# EasyEDA Pro project 校园作息系统.eprj

# Schematic Schematic1
Board Name: Board1; Create Date: 2024-12-30; Page Name: P1; Project Name: 校园作息系统; Schematic Name: Schematic1; Update Date: 2025-01-31; Company: 嘉立创EDA; Page Size: A4; Version: V1.0
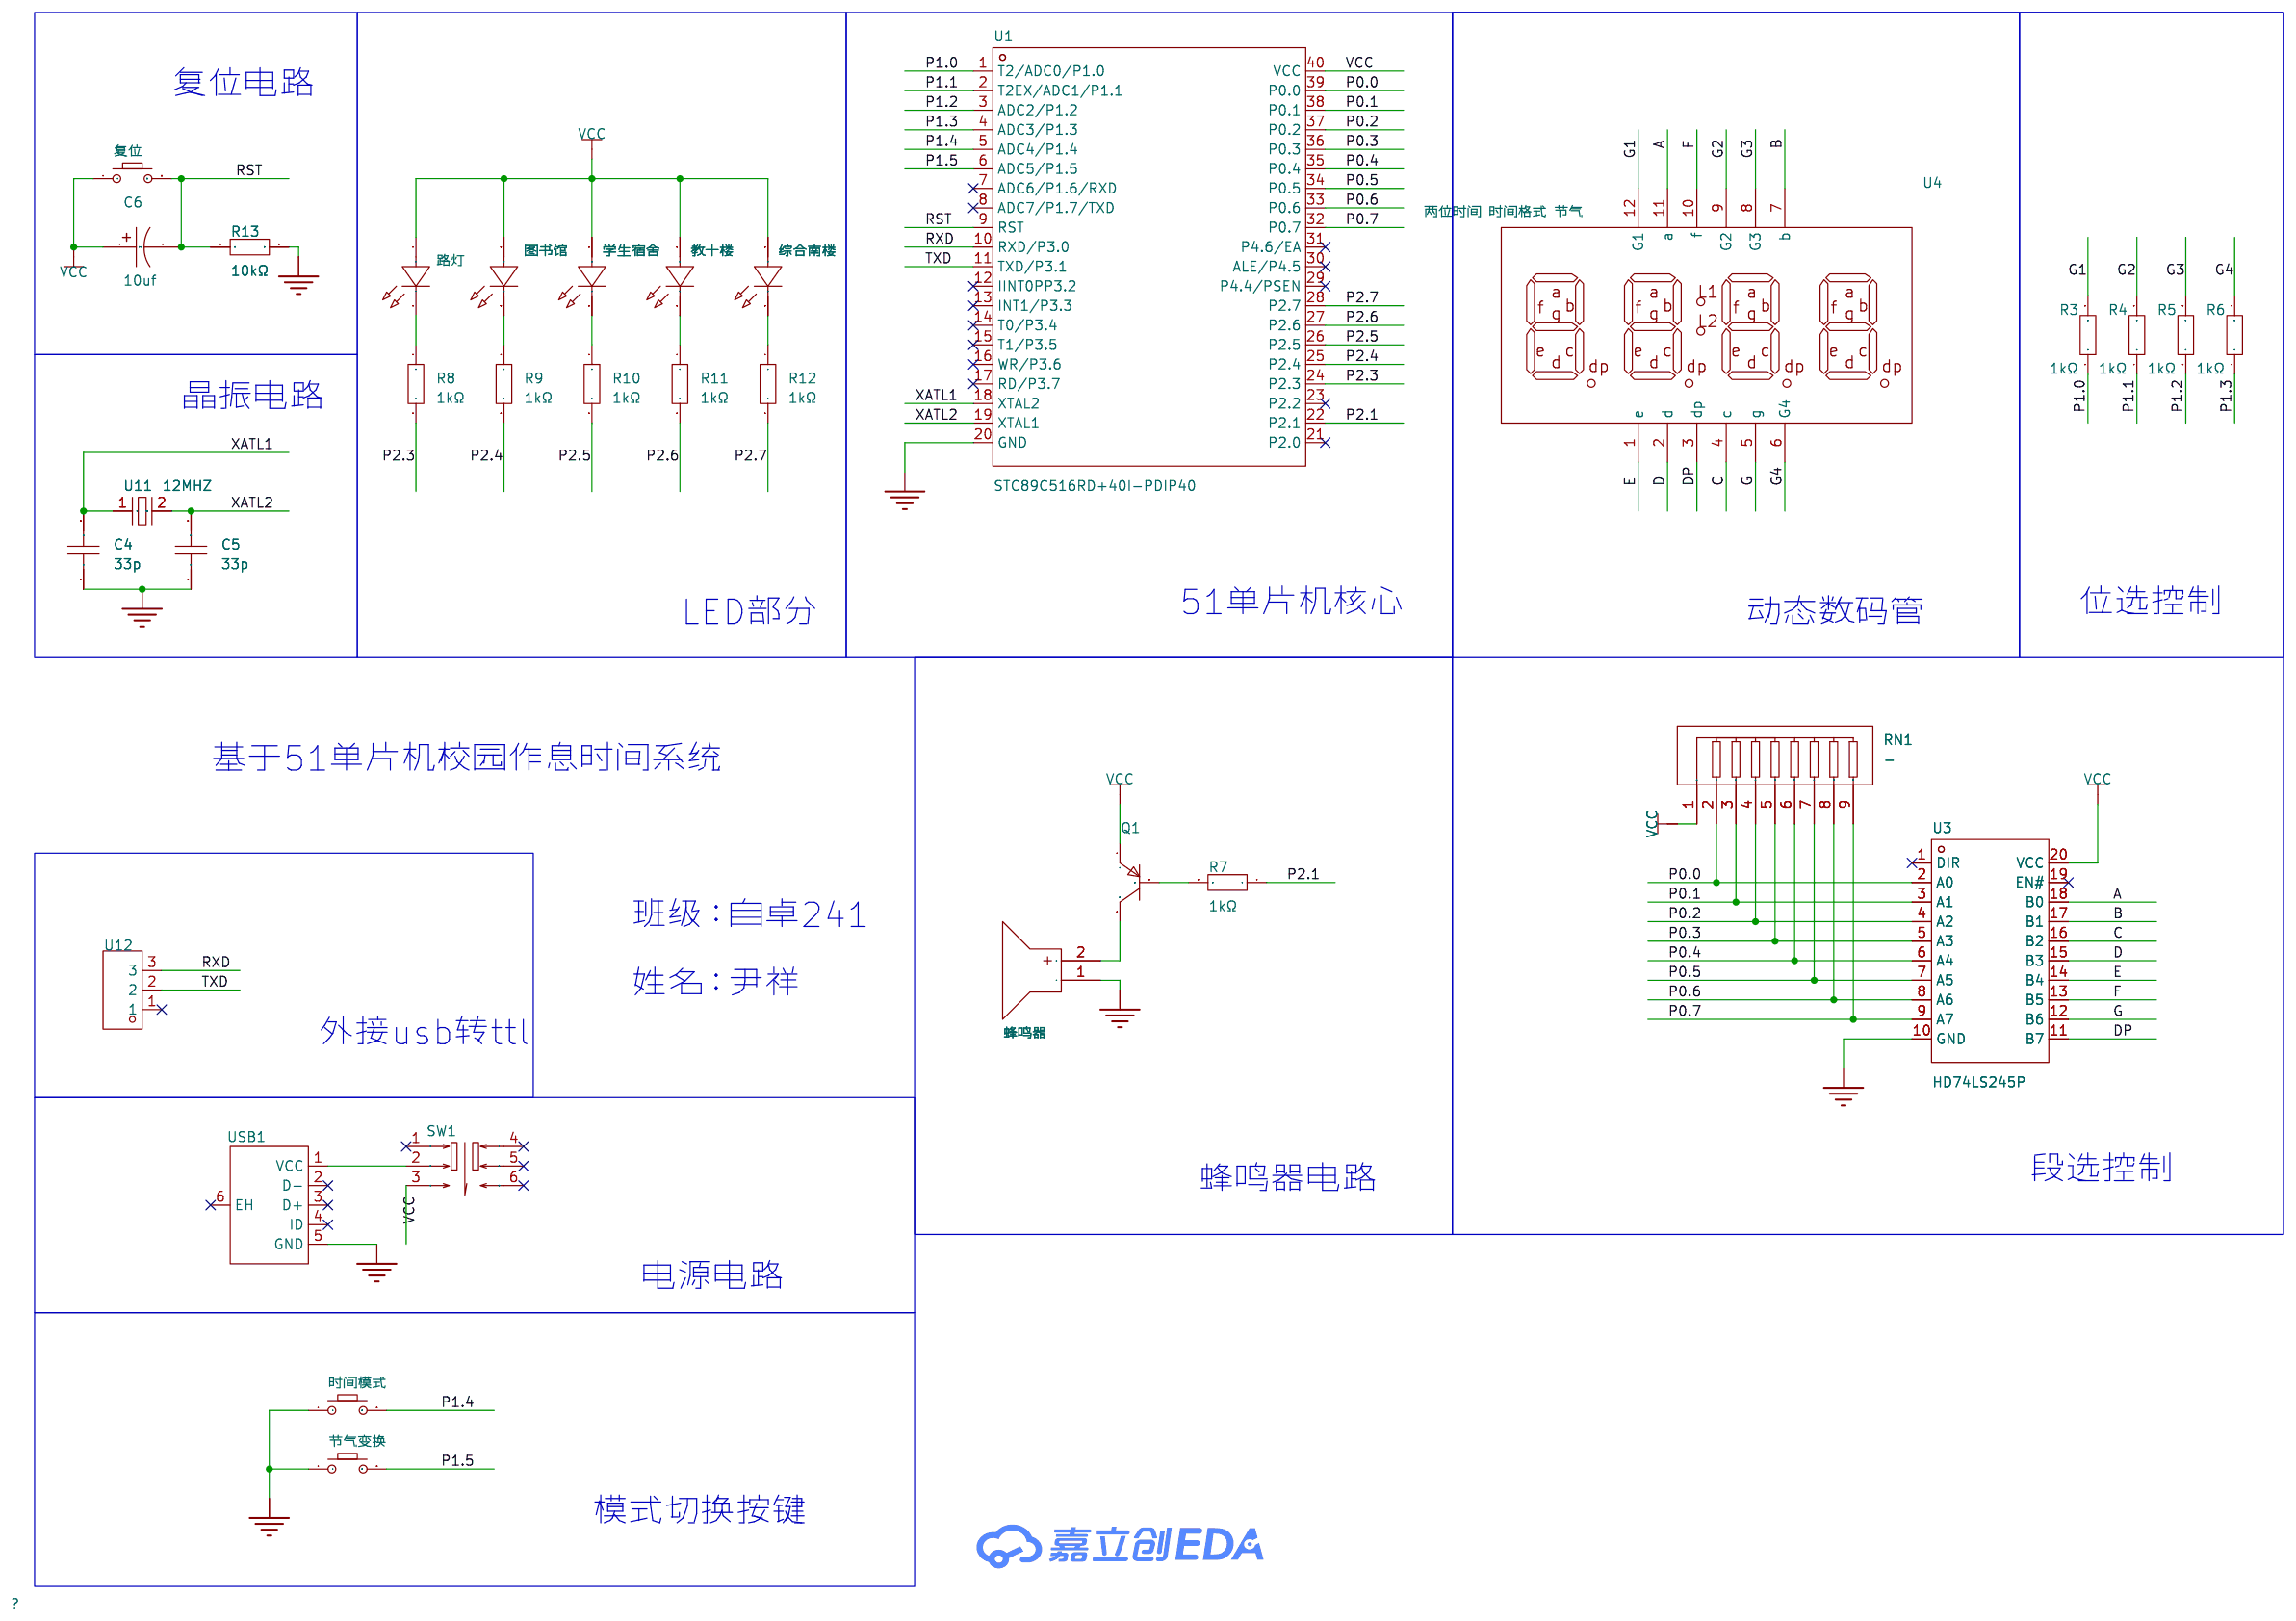
[diagram p0: schematic sheet]

## Parts
C4  33p  [CAP-TH_L10.0-W4.5-P7.50-D0.6]
C5  33p  [CAP-TH_L10.0-W4.5-P7.50-D0.6]
C6  10uf  [CAP-TH_BD10.0-P5.00-D0.6-FD]
Q1  -  [S8550P_TO-92]
R3  1kΩ  [Res_1/8W]
R4  1kΩ  [Res_1/8W]
R5  1kΩ  [Res_1/8W]
R6  1kΩ  [Res_1/8W]
R7  1kΩ  [Res_1/8W]
R8  1kΩ  [Res_1/8W]
R9  1kΩ  [Res_1/8W]
R10  1kΩ  [Res_1/8W]
R11  1kΩ  [Res_1/8W]
R12  1kΩ  [Res_1/8W]
R13  10kΩ  [Res_1/8W]
RN1  -  [RES-ARRAY-TH_9P-P2.54-D1.0]
SW1  SP-2212  [SW-TH_6P-L7.2-W7.2-P2.00-LS5.0]
U1  STC89C516RD+40I-PDIP40  [DIP-40_L52.3-W13.9-P2.54-LS15.2-BL]
U3  HD74LS245P  [DIP-20_L26.8-W6.4-P2.54-LS7.6-BL]
U4  两位时间 时间格式 节气  [LED-SEG-TH_12P-L32.1-W10.0-P12.7-S7.62-BL]
U11  12MHZ  [HC-49S_L11.0-W4.7-P4.88]
U12  2.54MM间距单排插针3P/高度11mm  [HDR-TH_3P-P2.54-V-M]
USB1  -  [USB_Micro]
图书馆  图书馆  [LED-TH_BD3.0-P2.54-FD]
复位  -  [Key_TH_3.5x6x4.3]
学生宿舍  学生宿舍  [LED-TH_BD3.0-P2.54-FD]
打铃  蜂鸣器  [BUZ-TH_BD12.0-P6.00-D0.9-RD]
教十楼  教十楼  [LED-TH_BD3.0-P2.54-FD]
时间模式  -  [Key_TH_3.5x6x4.3]
综合南楼  综合南楼  [LED-TH_BD3.0-P2.54-FD]
节气变换  -  [Key_TH_3.5x6x4.3]
路灯  路灯  [LED-TH_BD3.0-P2.54-FD]

## Library data of the parts
C4 C5 = 250V 0.1uF 5% CBB电容: LCSC Part Name: 0.1uF 5% 250V 电容; Supplier Part: C46804; Supplier Footprint: CBB电容 7.5mm; JLCPCB Part Class: 扩展库; Supplier: LCSC
C6 = LF221M1HBKJ1013VGN: Supplier Part: C9900022454; Supplier Footprint: 直插电解电容（高频）,220uF±20%,50V,Pitch=5mm,φ10mm,H13mm,剪脚，脚长3.6mm，佳维诚; JLCPCB Part Class: 扩展库; Supplier: LCSC
Q1 = S8550_TO_PNP: Supplier Footprint: TO-92
R3-R13 = Res_AXIAL-1/8W: Supplier Footprint: 轴向引线
RN1 = 排阻 10 K 5%: LCSC Part Name: 10KΩ (103) ±5%; Supplier Part: C26615; Supplier Footprint: 插件; JLCPCB Part Class: 扩展库; Supplier: LCSC
SW1 = SP-2212: 电路结构:双刀双掷;自锁/无锁:自锁;安装方式:直插;触点电流:100mA;额定电压 (DC):30V;作用力:230gf;机械寿命:1.2万次;; LCSC Part Name: 轻触开关自锁; Supplier Part: C589287; Manufacturer: RISHENG(日昇); Supplier Footprint: 插件; JLCPCB Part Class: 扩展库; Datasheet: https://atta.szlcsc.com/upload/public/pdf/source/20200922/C589287_2DDFEABD4C802D7BFB6520C1CABFFDEF.pdf; Supplier: LCSC; Circuit: 双刀双掷; Self Lock / No Lock: 自锁; Actuator Style: 矩形柱塞; Mounting Style: 直插; Contact Current: 100mA; Voltage Rating (DC): 30V; Insulation Resistance: 100MΩ; Actuator/Cap Color: 蓝色; Pin Style: PC引脚; Operating Force: 230gf; Mechanical Life: 1.2万次
U1 = STC89C516RD+40I-PDIP40: Supplier Part: C52225; Manufacturer: STC(宏晶); Supplier Footprint: DIP-40; JLCPCB Part Class: 扩展库; Datasheet: https://atta.szlcsc.com/upload/public/pdf/source/20180614/C87831_BBAF7FB8B286C29ACE4E9B180C033FEC.pdf; Supplier: LCSC; CPU Core: 51系列; Program Storage Size: 61KB; RAM Size: 1.25KB; GPIO Ports Number: 35; Operating Voltage Range: 3.5V~5.5V; Program Memory Type: FLASH; Operating Temperature Range: -40℃~+85℃; 16Bit Timer: 3; UART/USART: 1; Peripheral/Function: 看门狗; Watchdog: 有
U3 = HD74LS245P: Supplier Part: C5349; Manufacturer: RENESAS(瑞萨)/IDT; Supplier Footprint: DIP-20; JLCPCB Part Class: 扩展库; Datasheet: https://atta.szlcsc.com/upload/public/pdf/source/20161119/1479540128687.pdf; Supplier: LCSC
U4 = 0.28 4位 数码管: Supplier Part: C9900013351; Supplier Footprint: DIP-12; JLCPCB Part Class: 扩展库; Supplier: LCSC
U11 = 直插晶振: Supplier Part: C9900021663; Supplier Footprint: HC-49S; JLCPCB Part Class: 扩展库; Supplier: LCSC
U12 = 2.54MM间距单排插针3P/高度11mm: Supplier Part: C9900010938; JLCPCB Part Class: 扩展库; Supplier: LCSC
USB1 = USB_Micro-B: Supplier Footprint: SMD
图书馆 学生宿舍 教十楼 综合南楼 路灯 = 3mmFIR: Supplier Part: C9900095018; Supplier Footprint: LED-TH_LED-3MM_RED; JLCPCB Part Class: 扩展库; Supplier: LCSC
复位 时间模式 节气变换 = Key_TH_3.5x6x4.3: Supplier Footprint: 插件
打铃 = buzzer: Supplier Part: C9900014030; JLCPCB Part Class: 扩展库; Supplier: LCSC

## Nets
GND: C4.1 C5.1 R13.2 U1.20(GND) U3.10(GND) USB1.5(GND) 打铃.1(-) 时间模式.A 节气变换.A
VCC: C6.1 Q1.1(E) RN1.1 SW1.3 U1.40(VCC) U3.20(VCC) 图书馆.1(A) 复位.A 学生宿舍.1(A) 教十楼.1(A) 综合南楼.1(A) 路灯.1(A)
A: U3.18(B0) U4.11(a)
B: U3.17(B1) U4.7(b)
C: U3.16(B2) U4.4(c)
D: U3.15(B3) U4.2(d)
DP: U3.11(B7) U4.3(dp)
E: U3.14(B4) U4.1(e)
F: U3.13(B5) U4.10(f)
G: U3.12(B6) U4.5(g)
G1: R3.2 U4.12(G1)
G2: R4.2 U4.9(G2)
G3: R5.2 U4.8(G3)
G4: R6.2 U4.6(G4)
P0.0: RN1.2 U1.39(P0.0) U3.2(A0)
P0.1: RN1.3 U1.38(P0.1) U3.3(A1)
P0.2: RN1.4 U1.37(P0.2) U3.4(A2)
P0.3: RN1.5 U1.36(P0.3) U3.5(A3)
P0.4: RN1.6 U1.35(P0.4) U3.6(A4)
P0.5: RN1.7 U1.34(P0.5) U3.7(A5)
P0.6: RN1.8 U1.33(P0.6) U3.8(A6)
P0.7: RN1.9 U1.32(P0.7) U3.9(A7)
P1.0: R3.1 U1.1(T2/ADC0/P1.0)
P1.1: R4.1 U1.2(T2EX/ADC1/P1.1)
P1.2: R5.1 U1.3(ADC2/P1.2)
P1.3: R6.1 U1.4(ADC3/P1.3)
P1.4: U1.5(ADC4/P1.4) 时间模式.B
P1.5: U1.6(ADC5/P1.5) 节气变换.B
P2.1: R7.1 U1.22(P2.1)
P2.3: R8.2 U1.24(P2.3)
P2.4: R9.2 U1.25(P2.4)
P2.5: R10.2 U1.26(P2.5)
P2.6: R11.2 U1.27(P2.6)
P2.7: R12.2 U1.28(P2.7)
RST: C6.2 R13.1 U1.9(RST) 复位.B
RXD: U1.10(RXD/P3.0) U12.3
TXD: U1.11(TXD/P3.1) U12.2
XATL1: C4.2 U1.18(XTAL2) U11.1
XATL2: C5.2 U1.19(XTAL1) U11.2(GND)
$1N10647: Q1.3(C) 打铃.2(+)
$1N10659: Q1.2(B) R7.2
$1N10681: SW1.2 USB1.1(VCC)
$1N11318: R8.1 路灯.2(K)
$1N11325: R9.1 图书馆.2(K)
$1N11329: R10.1 学生宿舍.2(K)
$1N11337: R11.1 教十楼.2(K)
$1N11342: R12.1 综合南楼.2(K)

Not connected (* = marked no-connect by the designer): SW1 1* 4* 5* 6*; U1 7(ADC6/P1.6/RXD)* 8(ADC7/P1.7/TXD)* 12(IINT0PP3.2)* 13(INT1/P3.3)* 14(T0/P3.4)* 15(T1/P3.5)* 16(WR/P3.6)* 17(RD/P3.7)* 21(P2.0)* 23(P2.2)* 29(P4.4/PSEN)* 30(ALE/P4.5)* 31(P4.6/EA)*; U3 1(DIR)* 19(EN#)*; U12 1*; USB1 2(D-)* 3(D+)* 4(ID)* 6(EH)*

## Notes on the sheet
- 复位电路
- 晶振电路
- 51单片机核心
- 位选控制
- LED部分
- 动态数码管
- 基于51单片机校园作息时间系统
- 班级：自卓241
- 姓名：尹祥
- 外接usb转ttl
- 蜂鸣器电路
- 段选控制
- 电源电路
- 模式切换按键

# Board PCB1
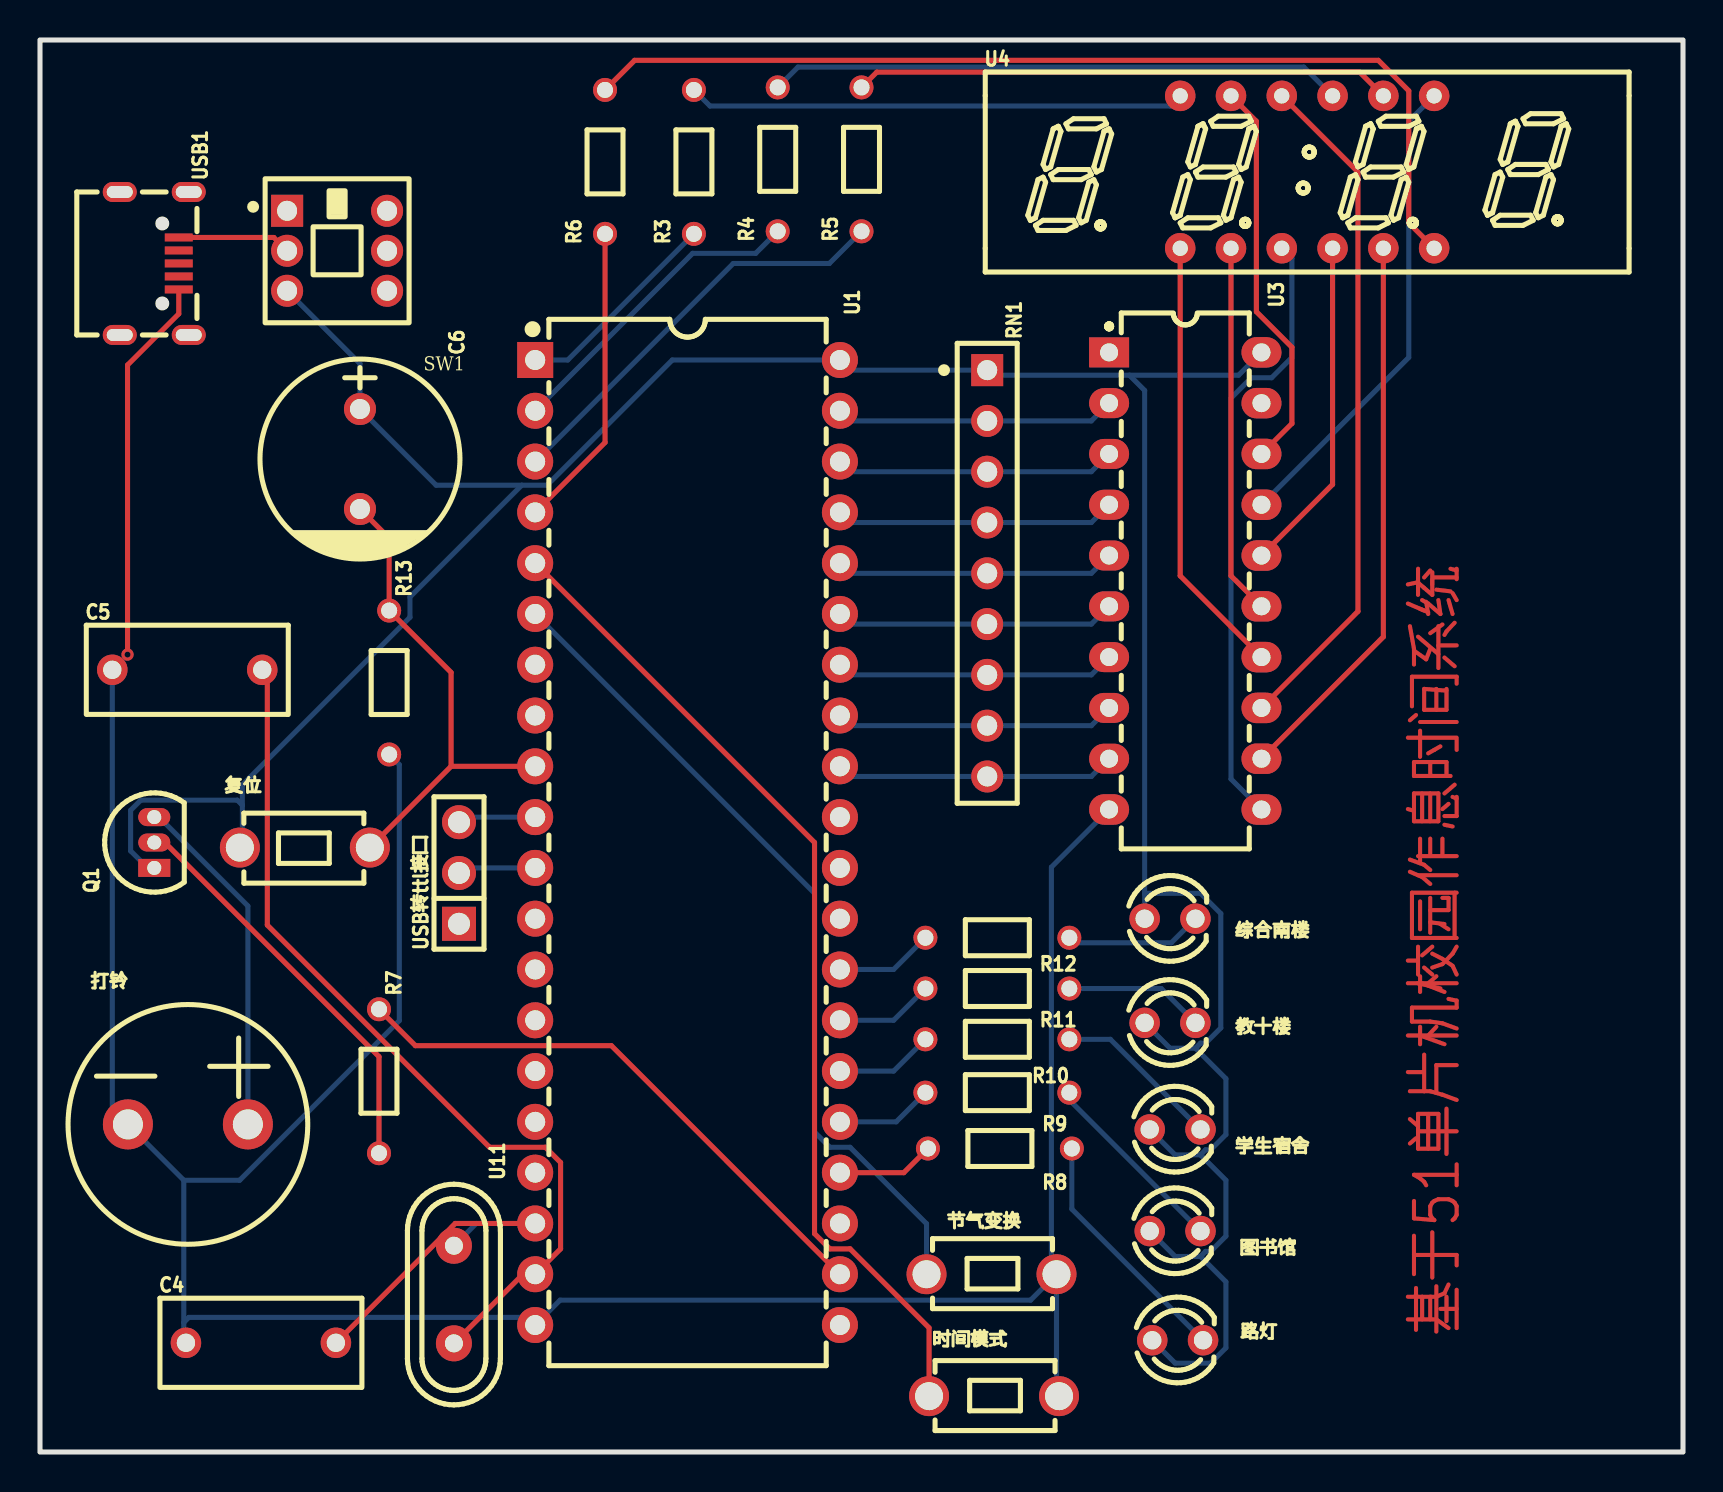
[diagram p1: board, top side]
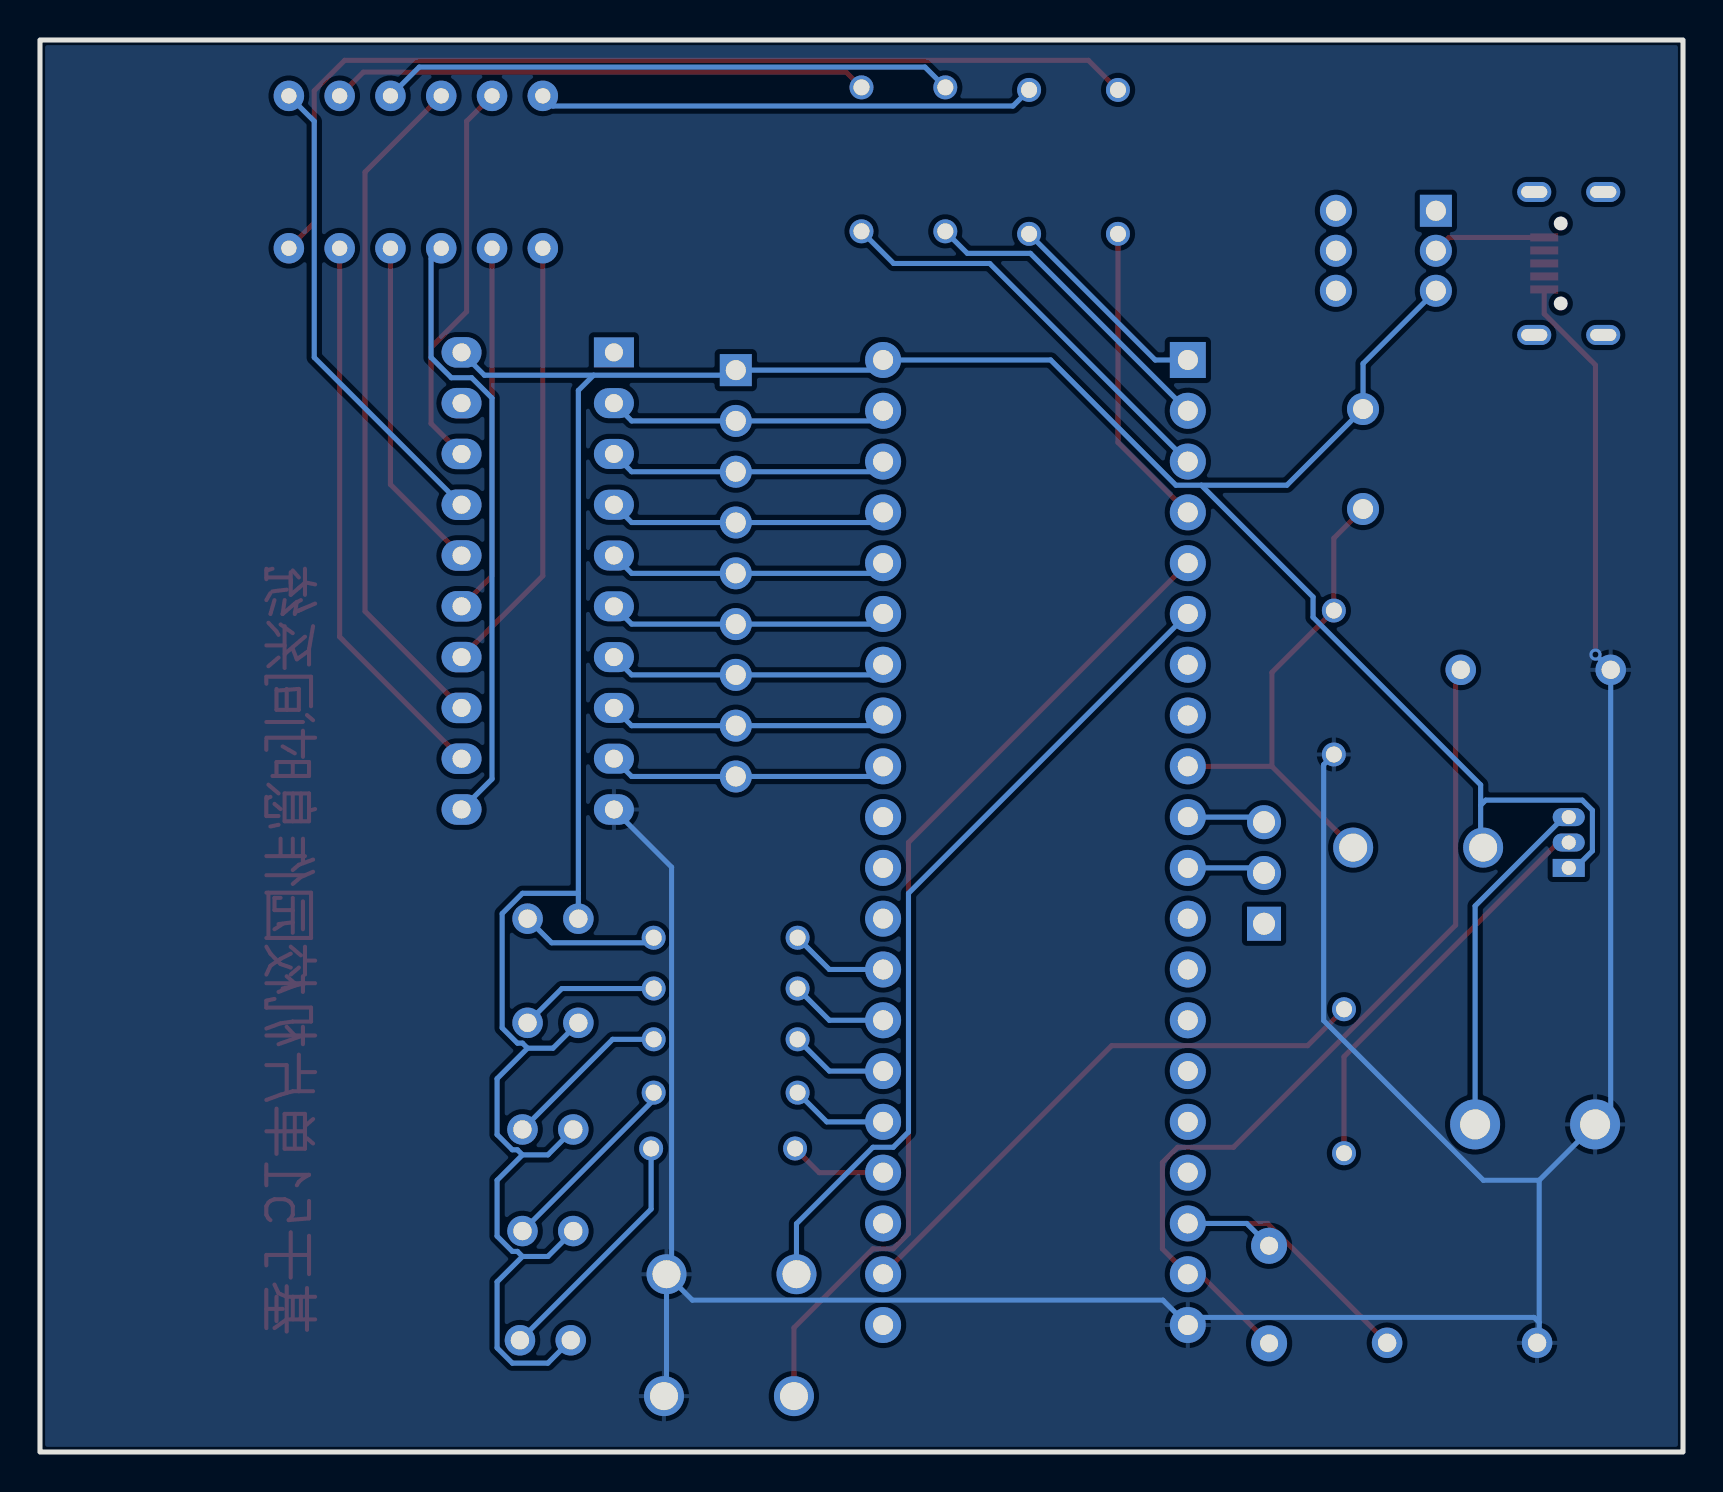
[diagram p2: board, bottom side, seen from below]

Outline 82.17 x 70.61 mm; copper layers: Top Layer, Bottom Layer. Coordinates in mm from the lower left corner of the outline.
Outline path: rectangle 0,70.61 82.17,0
Stack: Top Layer 0.035mm / Dielectric1 1.51mm FR4 er 4.5 / Bottom Layer 0.035mm

## Design rules (mm)
template: JLCPCB Capability(Two Layers Board)
spacing copperThickness1oz (default): track to track 0.102, other pairs 0.152 to 0.3
spacing copperThickness2oz: track to track 0.203, other pairs 0.152 to 0.3
track width copperThickness1oz (default): min 0.127, default 0.254, max 2.54
track width copperThickness2oz: min 0.203, default 0.254, max 2.54
differential pair differentialPair (default): width min 0.127, default 0.254, max 2.54; gap min 0.152, default 0.152
via viaSize (default): diameter min 0.5, default 0.61, max 10; hole min 0.3, default 0.305, max 6.3

## Placement (name value [footprint] x y rotation side)
C4  33p  [CAP-TH_L10.0-W4.5-P7.50-D0.6]  11.05 5.46 0 top
C5  33p  [CAP-TH_L10.0-W4.5-P7.50-D0.6]  7.37 39.12 0 top
C6  10uf  [CAP-TH_BD10.0-P5.00-D0.6-FD]  16 49.66 270 top
Q1  -  [S8550P_TO-92]  5.71 30.48 90 top
R3  1kΩ  [Res_1/8W]  32.77 64.52 90 top
R4  1kΩ  [Res_1/8W]  36.96 64.64 90 top
R5  1kΩ  [Res_1/8W]  41.15 64.64 90 top
R6  1kΩ  [Res_1/8W]  28.32 64.52 90 top
R7  1kΩ  [Res_1/8W]  16.89 18.54 270 top
R8  1kΩ  [Res_1/8W]  48.01 15.24 180 top
R9  1kΩ  [Res_1/8W]  47.88 18.03 180 top
R10  1kΩ  [Res_1/8W]  47.88 20.7 180 top
R11  1kΩ  [Res_1/8W]  47.88 23.24 180 top
R12  1kΩ  [Res_1/8W]  47.88 25.78 180 top
R13  10kΩ  [Res_1/8W]  17.4 38.48 270 top
RN1  -  [RES-ARRAY-TH_9P-P2.54-D1.0]  47.37 43.94 270 top
SW1  SP-2212  [SW-TH_6P-L7.2-W7.2-P2.00-LS5.0]  14.86 60.07 270 top
U1  STC89C516RD+40I-PDIP40  [DIP-40_L52.3-W13.9-P2.54-LS15.2-BL]  32.38 30.48 270 top
U3  HD74LS245P  [DIP-20_L26.8-W6.4-P2.54-LS7.6-BL]  57.28 43.56 270 top
U4  两位时间 时间格式 节气  [LED-SEG-TH_12P-L32.1-W10.0-P12.7-S7.62-BL]  63.37 64.01 0 top
U11  12MHZ  [HC-49S_L11.0-W4.7-P4.88]  20.7 7.87 270 top
USB1  -  [USB_Micro]  5.71 59.44 270 top
USB转ttl接口  2.54MM间距单排插针3P/高度11mm  [HDR-TH_3P-P2.54-V-M]  20.95 28.96 90 top
图书馆  图书馆  [LED-TH_BD3.0-P2.54-FD]  56.77 11.05 0 top
复位  -  [Key_TH_3.5x6x4.3]  13.08 30.23 0 top
学生宿舍  学生宿舍  [LED-TH_BD3.0-P2.54-FD]  56.77 16.13 0 top
打铃  蜂鸣器  [BUZ-TH_BD12.0-P6.00-D0.9-RD]  7.4 16.38 0 top
教十楼  教十楼  [LED-TH_BD3.0-P2.54-FD]  56.51 21.46 0 top
时间模式  -  [Key_TH_3.5x6x4.3]  47.88 2.79 180 top
综合南楼  综合南楼  [LED-TH_BD3.0-P2.54-FD]  56.51 26.67 0 top
节气变换  -  [Key_TH_3.5x6x4.3]  47.75 8.89 180 top
路灯  路灯  [LED-TH_BD3.0-P2.54-FD]  56.9 5.59 0 top

## Footprints (pads in the part's own frame, mm; a bottom-side part is the same pattern mirrored in y, then rotated)
BUZ-TH_BD12.0-P6.00-D0.9-RD
  round 2.5 hole 1.5: 1(-3,0) 2(3,0)
CAP-TH_BD10.0-P5.00-D0.6-FD
  round 1.6 hole 1: 1(-2.5,0) 2(2.5,0)
CAP-TH_L10.0-W4.5-P7.50-D0.6
  round 1.524 hole 0.914: 1(-3.75,0) 2(3.75,0)
DIP-20_L26.8-W6.4-P2.54-LS7.6-BL
  rect 1.5x2 hole 0.9: 1(-11.43,-3.81)
  oval 1.5x2 hole 0.9: 2(-8.89,-3.81) 3(-6.35,-3.81) 4(-3.81,-3.81) 5(-1.27,-3.81) 6(1.27,-3.81) 7(3.81,-3.81) 8(6.35,-3.81) 9(8.89,-3.81)
  oval 1.524x2 hole 0.9: 10(11.43,-3.81) 11(11.43,3.81) 12(8.89,3.81) 13(6.35,3.81) 14(3.81,3.81) 15(1.27,3.81) 16(-1.27,3.81) 17(-3.81,3.81) 18(-6.35,3.81) 19(-8.89,3.81) 20(-11.43,3.81)
DIP-40_L52.3-W13.9-P2.54-LS15.2-BL
  rect 1.8x1.8 hole 1: 1(-24.13,-7.62)
  round 1.8 hole 1: 2(-21.59,-7.62) 3(-19.05,-7.62) 4(-16.51,-7.62) 5(-13.97,-7.62) 6(-11.43,-7.62) 7(-8.89,-7.62) 8(-6.35,-7.62) 9(-3.81,-7.62) 10(-1.27,-7.62) 11(1.27,-7.62) 12(3.81,-7.62) 13(6.35,-7.62) 14(8.89,-7.62) 15(11.43,-7.62) 16(13.97,-7.62) 17(16.51,-7.62) 18(19.05,-7.62) 19(21.59,-7.62) 20(24.13,-7.62) 21(24.13,7.62) 22(21.59,7.62) 23(19.05,7.62) 24(16.51,7.62) 25(13.97,7.62) 26(11.43,7.62) 27(8.89,7.62) 28(6.35,7.62) 29(3.81,7.62) 30(1.27,7.62) 31(-1.27,7.62) 32(-3.81,7.62) 33(-6.35,7.62) 34(-8.89,7.62) 35(-11.43,7.62) 36(-13.97,7.62) 37(-16.51,7.62) 38(-19.05,7.62) 39(-21.59,7.62) 40(-24.13,7.62)
HC-49S_L11.0-W4.7-P4.88
  round 1.8 hole 0.9: 1(-2.44,0) 2(2.44,0)
HDR-TH_3P-P2.54-V-M
  rect 1.7x1.7 hole 1.1: 1(-2.54,0)
  round 1.7 hole 1.1: 2(0,0) 3(2.54,0)
Key_TH_3.5x6x4.3
  round 1.999 hole 1.399: A(-3.084,0) B(3.416,0)
LED-SEG-TH_12P-L32.1-W10.0-P12.7-S7.62-BL
  round 1.524 hole 0.762: 1(-6.35,-3.81) 2(-3.81,-3.81) 3(-1.27,-3.81) 4(1.27,-3.81) 5(3.81,-3.81) 6(6.35,-3.81) 7(6.35,3.81) 8(3.81,3.81) 9(1.27,3.81) 10(-1.27,3.81) 11(-3.81,3.81) 12(-6.35,3.81)
LED-TH_BD3.0-P2.54-FD
  round 1.524 hole 0.914: 1(-1.27,0) 2(1.27,0)
RES-ARRAY-TH_9P-P2.54-D1.0
  rect 1.6x1.6 hole 1: 1(-10.16,0)
  round 1.6 hole 1: 2(-7.62,0) 3(-5.08,0) 4(-2.54,0) 5(0,0) 6(2.54,0) 7(5.08,0) 8(7.62,0) 9(10.16,0)
Res_1/8W
  round 1.199 hole 0.8: 1(-3.599,0.063) 2(3.599,0.063)
S8550P_TO-92
  rect 0.9x1.6 hole 0.7: 1(-1.27,0)
  oval 0.9x1.6 hole 0.7: 2(0,0) 3(1.27,0)
SW-TH_6P-L7.2-W7.2-P2.00-LS5.0
  rect 1.6x1.6 hole 1: 1(-2,-2.5)
  round 1.6 hole 1: 2(0,-2.5) 3(2,-2.5) 4(-2,2.499) 5(0,2.5) 6(2,2.5)
USB_Micro
  rect 0.4x1.4 smd: 1(-1.3,1.225) 2(-0.65,1.225) 3(0,1.225) 4(0.65,1.225) 5(1.3,1.225)
  oval 1x1.7 hole 0.6x1.3: 6(-3.575,1.725) 6(-3.575,-1.725) 6(3.575,1.725) 6(3.575,-1.725)

## Nets
As in the schematic, except:
RXD: U1.10 USB转ttl接口.3
TXD: U1.11 USB转ttl接口.2

Pads without a net: SW1 1 4 5 6; U1 7 8 12 13 14 15 16 17 21 23 29 30 31; U3 1 19; USB1 2 3 4 6; USB转ttl接口 1

## Via types
v1: diameter 0.61, hole 0.305, Top Layer to Bottom Layer, 1 via

## Routing (per net, layer and track width the routed paths; a pad name or vN(x,y) marks a point on that pad's centre or on a via; arc(x,y) is an arc through that point)
GND: length 158.8
  Top Layer w0.254: v1(4.38,39.88) 4.38,54.36 6.94,56.92 6.94,58.14
  Bottom Layer w0.254: U3.10 50.58,29.25 50.58,9.14 节气变换.A ; C4.1 7.19,5.57 7.19,6.48 ; 7.19,13.59 7.19,6.48 ; 7.19,13.59 打铃.1 3.62,17.16 C5.1 v1(4.38,39.88) ; 7.19,13.59 9.98,13.59 17.97,21.57 17.97,34.37 R13.2 ; 7.19,6.48 7.44,6.73 24.38,6.73 U1.20 26.01,7.59 49.54,7.59 节气变换.A ; 节气变换.A 50.84,2.92 时间模式.A
VCC: length 161.7
  Bottom Layer w0.254: 57.78,20.19 56.51,20.19 教十楼.1 ; 57.78,20.19 58.04,20.45 58.29,20.45 59.06,21.21 59.06,26.92 58.04,27.94 55.25,27.94 ; 57.78,20.19 59.31,18.67 59.31,15.87 58.55,15.11 58.29,15.11 58.04,14.86 ; U3.20 59.94,53.85 54.48,53.85 ; 24.09,48.35 25.36,48.35 31.62,54.61 U1.40 40.51,54.1 RN1.1 47.62,53.85 54.48,53.85 ; 24.09,48.35 19.81,48.35 C6.1 16,54.43 SW1.3 ; 24.09,48.35 18.5,42.76 18.5,41.74 10.12,33.36 10.12,32.34 ; 图书馆.1 56.77,9.78 58.04,9.78 ; 55.25,27.94 55.25,53.09 54.48,53.85 ; 55.25,27.94 综合南楼.1 ; 5.71,29.21 5.38,29.21 4.53,30.06 4.53,32.09 5.04,32.6 9.87,32.6 10.12,32.34 ; 58.04,14.86 56.77,14.86 学生宿舍.1 ; 58.04,14.86 59.31,13.59 59.31,10.79 58.55,10.03 58.29,10.03 58.04,9.78 ; 路灯.1 56.77,4.44 58.55,4.44 59.31,5.21 59.31,8.51 58.04,9.78 ; 10.12,32.34 10.12,30.35 复位.A
A: length 19.8
  Top Layer w0.254: U3.18 62.61,51.43 62.61,55.24 60.83,57.02 60.83,66.55 U4.11
B: length 24
  Bottom Layer w0.254: U3.17 68.45,54.74 68.45,66.55 U4.7
C: length 16.8
  Top Layer w0.254: U4.4 64.64,48.39 U3.16
D: length 18.5
  Top Layer w0.254: U3.15 59.56,43.81 U4.2
DP: length 30.8
  Bottom Layer w0.254: U4.3 62.61,59.69 62.61,54.74 61.59,53.72 60.58,53.72 59.56,52.7 59.56,33.65 U3.11
E: length 22.1
  Top Layer w0.254: U3.14 57.02,43.81 U4.1
F: length 34.2
  Top Layer w0.254: U4.10 65.91,64.01 65.91,42.04 U3.13
G: length 28.1
  Top Layer w0.254: U3.12 67.18,40.77 U4.5
G1: length 24.9
  Bottom Layer w0.254: U4.12 56.51,67.31 33.51,67.31 R3.2
G2: length 28.8
  Bottom Layer w0.254: U4.9 63.2,69.26 37.91,69.26 R4.2
G3: length 26.9
  Top Layer w0.254: U4.8 66,69 41.85,69 R5.2
G4: length 49.8
  Top Layer w0.254: 28.26,68.11 29.74,69.6 66.93,69.6 68.45,68.07 68.45,61.47 U4.6
P0.0: length 14
  Bottom Layer w0.254: U3.2 52.58,51.56 40.51,51.56 U1.39
P0.1: length 14
  Bottom Layer w0.254: U3.3 52.58,49.02 RN1.3 40.51,49.02 U1.38
P0.2: length 14
  Bottom Layer w0.254: 40,46.99 40.51,46.48 52.58,46.48 U3.4
P0.3: length 14
  Bottom Layer w0.254: U3.5 52.58,43.94 RN1.5 40.51,43.94 U1.36
P0.4: length 14
  Bottom Layer w0.254: 40,41.91 40.51,41.4 RN1.6 52.58,41.4 U3.6
P0.5: length 14
  Bottom Layer w0.254: U3.7 52.58,38.86 40.51,38.86 U1.34
P0.6: length 14
  Bottom Layer w0.254: U3.8 52.58,36.32 RN1.8 40.51,36.32 U1.33
P0.7: length 14
  Bottom Layer w0.254: U3.9 52.58,33.78 40.51,33.78 U1.32
P1.0: length 10.6
  Bottom Layer w0.254: U1.1 26.4,54.61 R3.1
P1.1: length 15.8
  Bottom Layer w0.254: U1.2 32.64,59.94 35.79,59.94 R4.1
P1.2: length 21.1
  Bottom Layer w0.254: R5.1 39.48,59.44 34.67,59.44 U1.3
P1.3: length 15.4
  Top Layer w0.254: 24.76,46.99 28.26,50.48 28.26,60.92
P1.4: length 50.4
  Top Layer w0.254: 时间模式.B 44.46,6.21 40.51,10.16 39.5,10.16 38.73,10.92 38.73,30.48 U1.5
P1.5: length 41.7
  Bottom Layer w0.254: 24.76,41.91 38.73,27.94 38.73,16 39.5,15.24 40.51,15.24 44.34,11.42 节气变换.B
P2.1: length 28.5
  Top Layer w0.254: U1.22 28.57,20.32 18.77,20.32 R7.1
P2.3: length 4.9
  Top Layer w0.254: R8.2 43.2,13.97 U1.24
P2.4: length 4.9
  Bottom Layer w0.254: R9.2 42.82,16.51 U1.25
P2.5: length 4.9
  Bottom Layer w0.254: U1.26 42.69,19.05 R10.2
P2.6: length 4.9
  Bottom Layer w0.254: R11.2 42.69,21.59 U1.27
P2.7: length 4.9
  Bottom Layer w0.254: R12.2 42.69,24.13 40,24.13
RST: length 24.7
  Top Layer w0.254: 20.56,34.29 20.56,38.98 R13.1 17.46,45.7 C6.2 ; 20.56,34.29 U1.9 ; 20.56,34.29 复位.B
RXD: length 3.9
  Bottom Layer w0.254: U1.10 21.21,31.75 USB转ttl接口.3
TXD: length 3.9
  Bottom Layer w0.254: 24.76,29.21 21.21,29.21 USB转ttl接口.2
XATL1: length 17
  Top Layer w0.254: C4.2 20.77,11.43 U1.18
  Bottom Layer w0.254: U11.1 21.82,11.43 U1.18
XATL2: length 44.1
  Top Layer w0.254: U11.2 24.16,8.89 U1.19 26.03,10.16 26.03,14.48 25.27,15.24 22.48,15.24 11.37,26.35 11.37,38.86 C5.2
$1N10647: length 17.4
  Bottom Layer w0.254: Q1.3 5.95,31.75 10.4,27.3 打铃.2
$1N10659: length 20.5
  Top Layer w0.254: R7.2 16.95,19.77 6.29,30.44 5.76,30.44 Q1.2
$1N10681: length 5.7
  Top Layer w0.254: 6.94,60.74 11.69,60.74 SW1.2
$1N11318: length 12.3
  Bottom Layer w0.254: 路灯.2 51.6,12.15 R8.1
$1N11325: length 9.6
  Bottom Layer w0.254: 图书馆.2 51.48,17.61 R9.1
$1N11329: length 8.4
  Bottom Layer w0.254: R10.1 53.53,20.64 学生宿舍.2
$1N11337: length 7
  Bottom Layer w0.254: 教十楼.2 56.07,23.18 R11.1
$1N11342: length 6.9
  Bottom Layer w0.254: R12.1 51.73,25.46 56.58,25.46 综合南楼.2

## Copper pours and planes (outline as drawn; the poured copper is in the pictures)
GND on Bottom Layer: 0,70.61 82.17,70.61 82.17,0 0,0

## Text on the board
Top Layer: 基于51单片机校园作息时间系统
